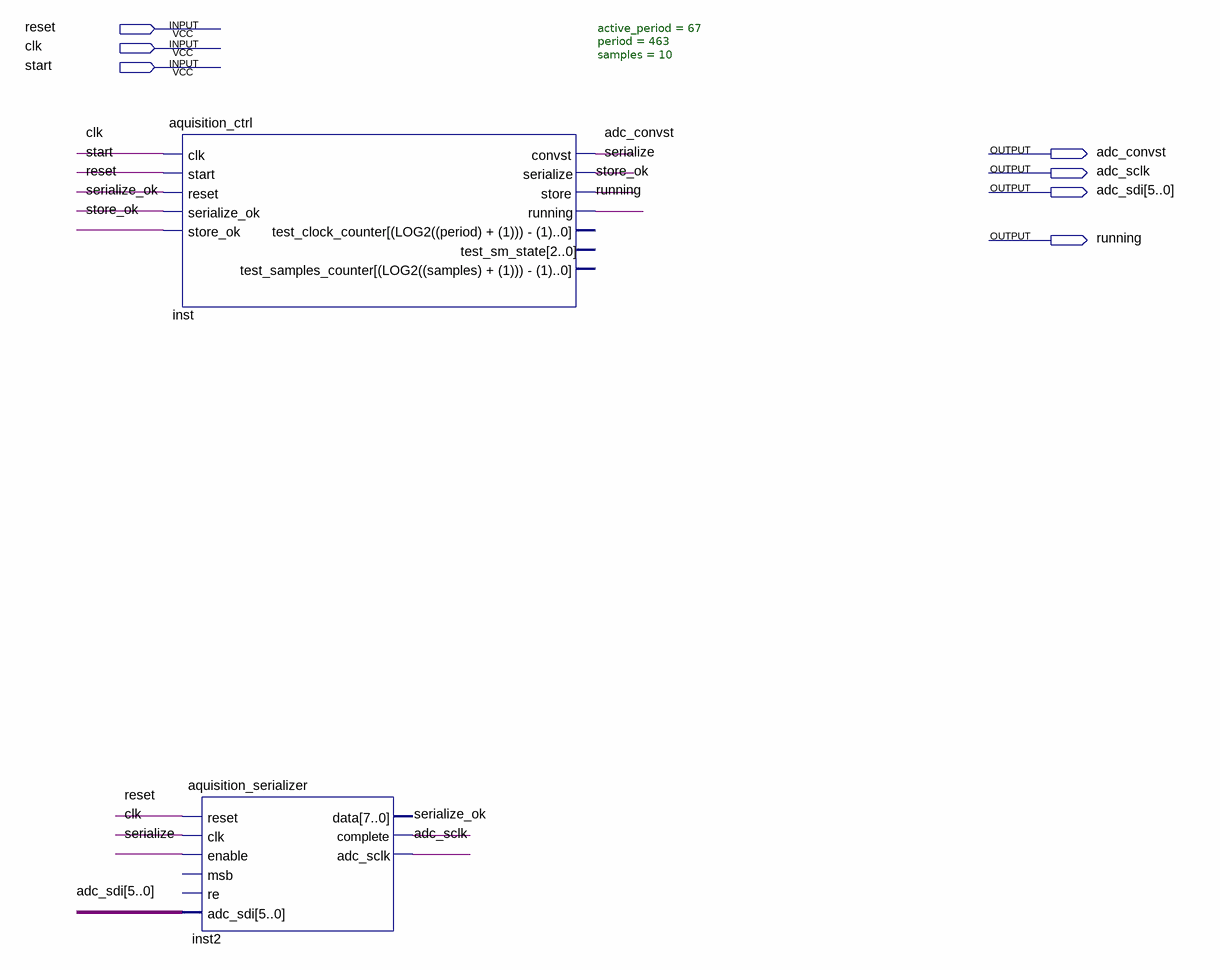
[diagram p0: schematic sheet]
// Quartus schematic aquisition_module.bdf as structural Verilog: 2 symbols, 7 pins
module aquisition_module (
  input  reset,
  input  clk,
  input  start,
  output adc_convst,
  output adc_sclk,
  output [5:0] adc_sdi,
  output running
);

  wire serialize, serialize_ok, store_ok;

  aquisition_ctrl #(.active_period(67), .period(463), .samples(10)) inst (
    .clk(clk), .start(start), .reset(reset), .serialize_ok(serialize_ok), .store_ok(store_ok),
    .convst(adc_convst), .serialize(serialize), .store(store_ok), .running(running));  // open: test_clock_counter, test_sm_state, test_samples_counter
  aquisition_serializer inst2 (
    .reset(reset), .clk(clk), .enable(serialize), .adc_sdi(adc_sdi), .complete(serialize_ok),
    .adc_sclk(adc_sclk));  // open: msb, re, data
endmodule
